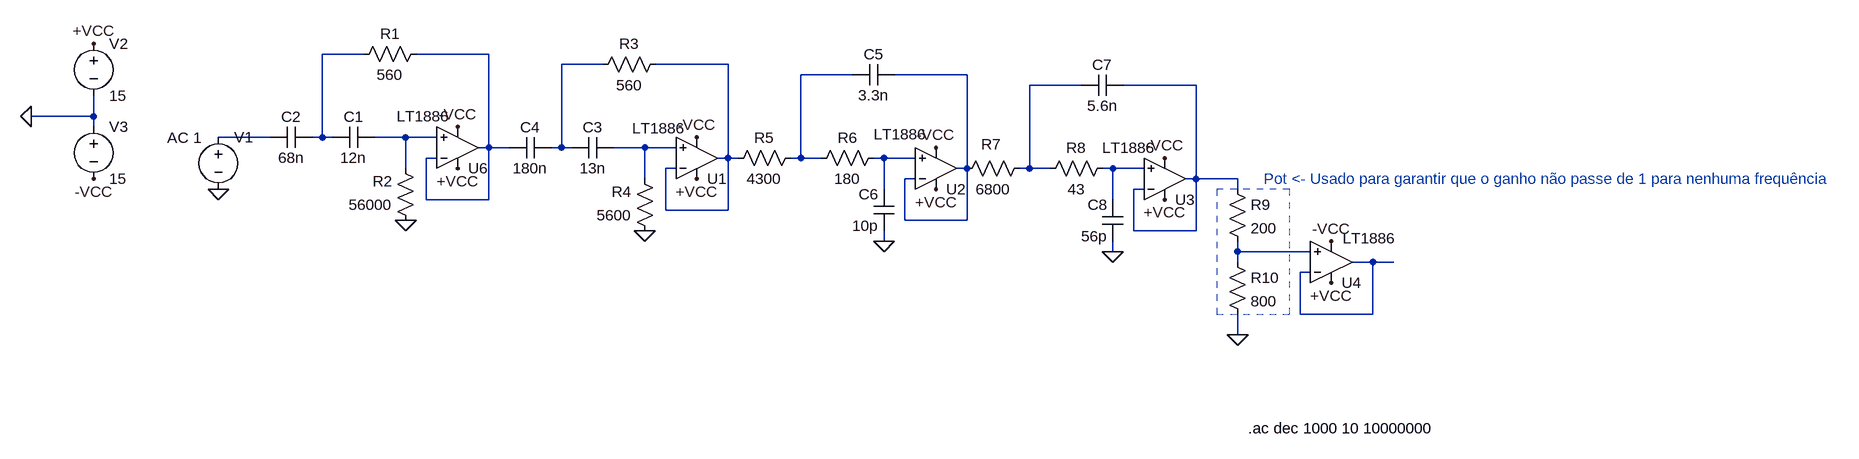
[diagram p0: schematic Draft1.asc]
Draft1.asc, the LTspice schematic file:
Version 4
SHEET 1 2416 812
WIRE 112 48 48 48
WIRE 304 48 192 48
WIRE 480 64 416 64
WIRE 672 64 560 64
WIRE 864 80 784 80
WIRE 1040 80 928 80
WIRE 1216 96 1136 96
WIRE 1392 96 1280 96
WIRE -304 144 -304 112
WIRE -304 144 -400 144
WIRE -304 160 -304 144
WIRE -32 176 -112 176
WIRE 48 176 48 48
WIRE 48 176 32 176
WIRE 64 176 48 176
WIRE 176 176 128 176
WIRE 224 176 176 176
WIRE 304 192 304 48
WIRE 304 192 288 192
WIRE 336 192 304 192
WIRE 416 192 416 64
WIRE 416 192 400 192
WIRE 432 192 416 192
WIRE 544 192 496 192
WIRE 592 192 544 192
WIRE 224 208 208 208
WIRE 672 208 672 64
WIRE 672 208 656 208
WIRE 688 208 672 208
WIRE 784 208 784 80
WIRE 784 208 768 208
WIRE 816 208 784 208
WIRE 912 208 896 208
WIRE 960 208 912 208
WIRE 176 224 176 176
WIRE 592 224 576 224
WIRE 1040 224 1040 80
WIRE 1040 224 1024 224
WIRE 1136 224 1136 96
WIRE 1136 224 1120 224
WIRE 1168 224 1136 224
WIRE 1264 224 1248 224
WIRE 1312 224 1264 224
WIRE 544 240 544 192
WIRE 960 240 944 240
WIRE 1392 240 1392 96
WIRE 1392 240 1376 240
WIRE 1456 240 1392 240
WIRE 912 256 912 208
WIRE 1312 256 1296 256
WIRE 1456 256 1456 240
WIRE 208 272 208 208
WIRE 304 272 304 192
WIRE 304 272 208 272
WIRE 1264 272 1264 224
WIRE 576 288 576 224
WIRE 672 288 672 208
WIRE 672 288 576 288
WIRE 944 304 944 240
WIRE 1040 304 1040 224
WIRE 1040 304 944 304
WIRE 1296 320 1296 256
WIRE 1392 320 1392 240
WIRE 1392 320 1296 320
WIRE 912 336 912 320
WIRE 1264 352 1264 336
WIRE 1456 352 1456 336
WIRE 1568 352 1456 352
WIRE 1456 368 1456 352
WIRE 1664 368 1632 368
WIRE 1696 368 1664 368
WIRE 1568 384 1552 384
WIRE 1552 448 1552 384
WIRE 1664 448 1664 368
WIRE 1664 448 1552 448
WIRE 1456 480 1456 448
FLAG 176 304 0
FLAG 544 320 0
FLAG 912 336 0
FLAG 1264 352 0
FLAG 1456 480 0
FLAG -112 256 0
FLAG -400 144 0
FLAG -304 32 +VCC
FLAG 256 224 +VCC
FLAG 624 240 +VCC
FLAG 992 256 +VCC
FLAG 1344 272 +VCC
FLAG 1600 400 +VCC
FLAG -304 240 -VCC
FLAG 256 160 -VCC
FLAG 624 176 -VCC
FLAG 1344 208 -VCC
FLAG 1600 336 -VCC
FLAG 992 192 -VCC
SYMBOL res 208 32 R90
WINDOW 0 0 56 VBottom 2
WINDOW 3 32 56 VTop 2
SYMATTR InstName R1
SYMATTR Value 560
SYMBOL res 192 320 R180
WINDOW 0 36 76 Left 2
WINDOW 3 36 40 Left 2
SYMATTR InstName R2
SYMATTR Value 56000
SYMBOL cap 128 160 R90
WINDOW 0 0 32 VBottom 2
WINDOW 3 32 32 VTop 2
SYMATTR InstName C1
SYMATTR Value 12n
SYMBOL cap 32 160 R90
WINDOW 0 0 32 VBottom 2
WINDOW 3 32 32 VTop 2
SYMATTR InstName C2
SYMATTR Value 68n
SYMBOL res 576 48 R90
WINDOW 0 0 56 VBottom 2
WINDOW 3 32 56 VTop 2
SYMATTR InstName R3
SYMATTR Value 560
SYMBOL res 560 336 R180
WINDOW 0 36 76 Left 2
WINDOW 3 36 40 Left 2
SYMATTR InstName R4
SYMATTR Value 5600
SYMBOL cap 496 176 R90
WINDOW 0 0 32 VBottom 2
WINDOW 3 32 32 VTop 2
SYMATTR InstName C3
SYMATTR Value 13n
SYMBOL cap 400 176 R90
WINDOW 0 0 32 VBottom 2
WINDOW 3 32 32 VTop 2
SYMATTR InstName C4
SYMATTR Value 180n
SYMBOL cap 928 64 R90
WINDOW 0 0 32 VBottom 2
WINDOW 3 32 32 VTop 2
SYMATTR InstName C5
SYMATTR Value 3.3n
SYMBOL cap 928 320 R180
WINDOW 0 24 56 Left 2
WINDOW 3 24 8 Left 2
SYMATTR InstName C6
SYMATTR Value 10p
SYMBOL res 784 192 R90
WINDOW 0 0 56 VBottom 2
WINDOW 3 32 56 VTop 2
SYMATTR InstName R5
SYMATTR Value 4300
SYMBOL res 912 192 R90
WINDOW 0 0 56 VBottom 2
WINDOW 3 32 56 VTop 2
SYMATTR InstName R6
SYMATTR Value 180
SYMBOL cap 1280 80 R90
WINDOW 0 0 32 VBottom 2
WINDOW 3 32 32 VTop 2
SYMATTR InstName C7
SYMATTR Value 5.6n
SYMBOL cap 1280 336 R180
WINDOW 0 24 56 Left 2
WINDOW 3 24 8 Left 2
SYMATTR InstName C8
SYMATTR Value 56p
SYMBOL res 1136 208 R90
WINDOW 0 -6 59 VBottom 2
WINDOW 3 32 56 VTop 2
SYMATTR InstName R7
SYMATTR Value 6800
SYMBOL res 1264 208 R90
WINDOW 0 0 56 VBottom 2
WINDOW 3 32 56 VTop 2
SYMATTR InstName R8
SYMATTR Value 43
SYMBOL voltage -112 160 R0
WINDOW 3 -79 17 Left 2
WINDOW 123 0 0 Left 2
WINDOW 39 0 0 Left 2
SYMATTR Value AC 1
SYMATTR InstName V1
SYMBOL voltage -304 16 R0
WINDOW 123 0 0 Left 2
WINDOW 39 0 0 Left 2
SYMATTR InstName V2
SYMATTR Value 15
SYMBOL voltage -304 144 R0
WINDOW 123 0 0 Left 2
WINDOW 39 0 0 Left 2
SYMATTR InstName V3
SYMATTR Value 15
SYMBOL Opamps\\LT1886 256 256 M180
WINDOW 3 -94 112 Left 2
SYMATTR InstName U6
SYMBOL Opamps\\LT1886 624 272 M180
WINDOW 3 -99 110 Left 2
SYMATTR InstName U1
SYMBOL Opamps\\LT1886 992 288 M180
WINDOW 3 -96 117 Left 2
SYMATTR InstName U2
SYMBOL Opamps\\LT1886 1344 304 M180
WINDOW 3 -96 112 Left 2
SYMATTR InstName U3
SYMBOL res 1440 240 R0
SYMATTR InstName R9
SYMATTR Value 200
SYMBOL res 1440 352 R0
SYMATTR InstName R10
SYMATTR Value 800
SYMBOL Opamps\\LT1886 1600 432 M180
WINDOW 3 18 101 Left 2
SYMATTR InstName U4
TEXT 1472 624 Left 2 !.ac dec 1000 10 10000000
TEXT 1496 240 Left 2 ;Pot <- Usado para garantir que o ganho não passe de 1 para nenhuma frequência
RECTANGLE Normal 1424 448 1536 256 2

The netlist it stands for:
* Draft1.asc
R1 N002 N001 560
R2 0 N010 56000
C1 N010 N001 12n
C2 N001 N009 68n
R3 N004 N003 560
R4 0 N011 5600
C3 N011 N003 13n
C4 N003 N002 180n
C5 N006 N005 3.3n
C6 0 N012 10p
R5 N005 N004 4300
R6 N012 N005 180
C7 N008 N007 5.6n
C8 0 N013 56p
R7 N007 N006 6800
R8 N013 N007 43
V1 N009 0 AC 1
V2 +VCC 0 15
V3 0 -VCC 15
XU6 N010 N002 +VCC -VCC N002 LT1886  ; pins In+ In- V+ V- OUT
XU1 N011 N004 +VCC -VCC N004 LT1886  ; pins In+ In- V+ V- OUT
XU2 N012 N006 +VCC -VCC N006 LT1886  ; pins In+ In- V+ V- OUT
XU3 N013 N008 +VCC -VCC N008 LT1886  ; pins In+ In- V+ V- OUT
R9 N008 N014 200
R10 N014 0 800
XU4 N014 N015 +VCC -VCC N015 LT1886  ; pins In+ In- V+ V- OUT
.ac dec 1000 10 10000000
* Pot <- Usado para garantir que o ganho não passe de 1 para nenhuma frequência
.backanno
.end